# Altium schematic sheet 01.SchDoc
size 420 x 297 mm
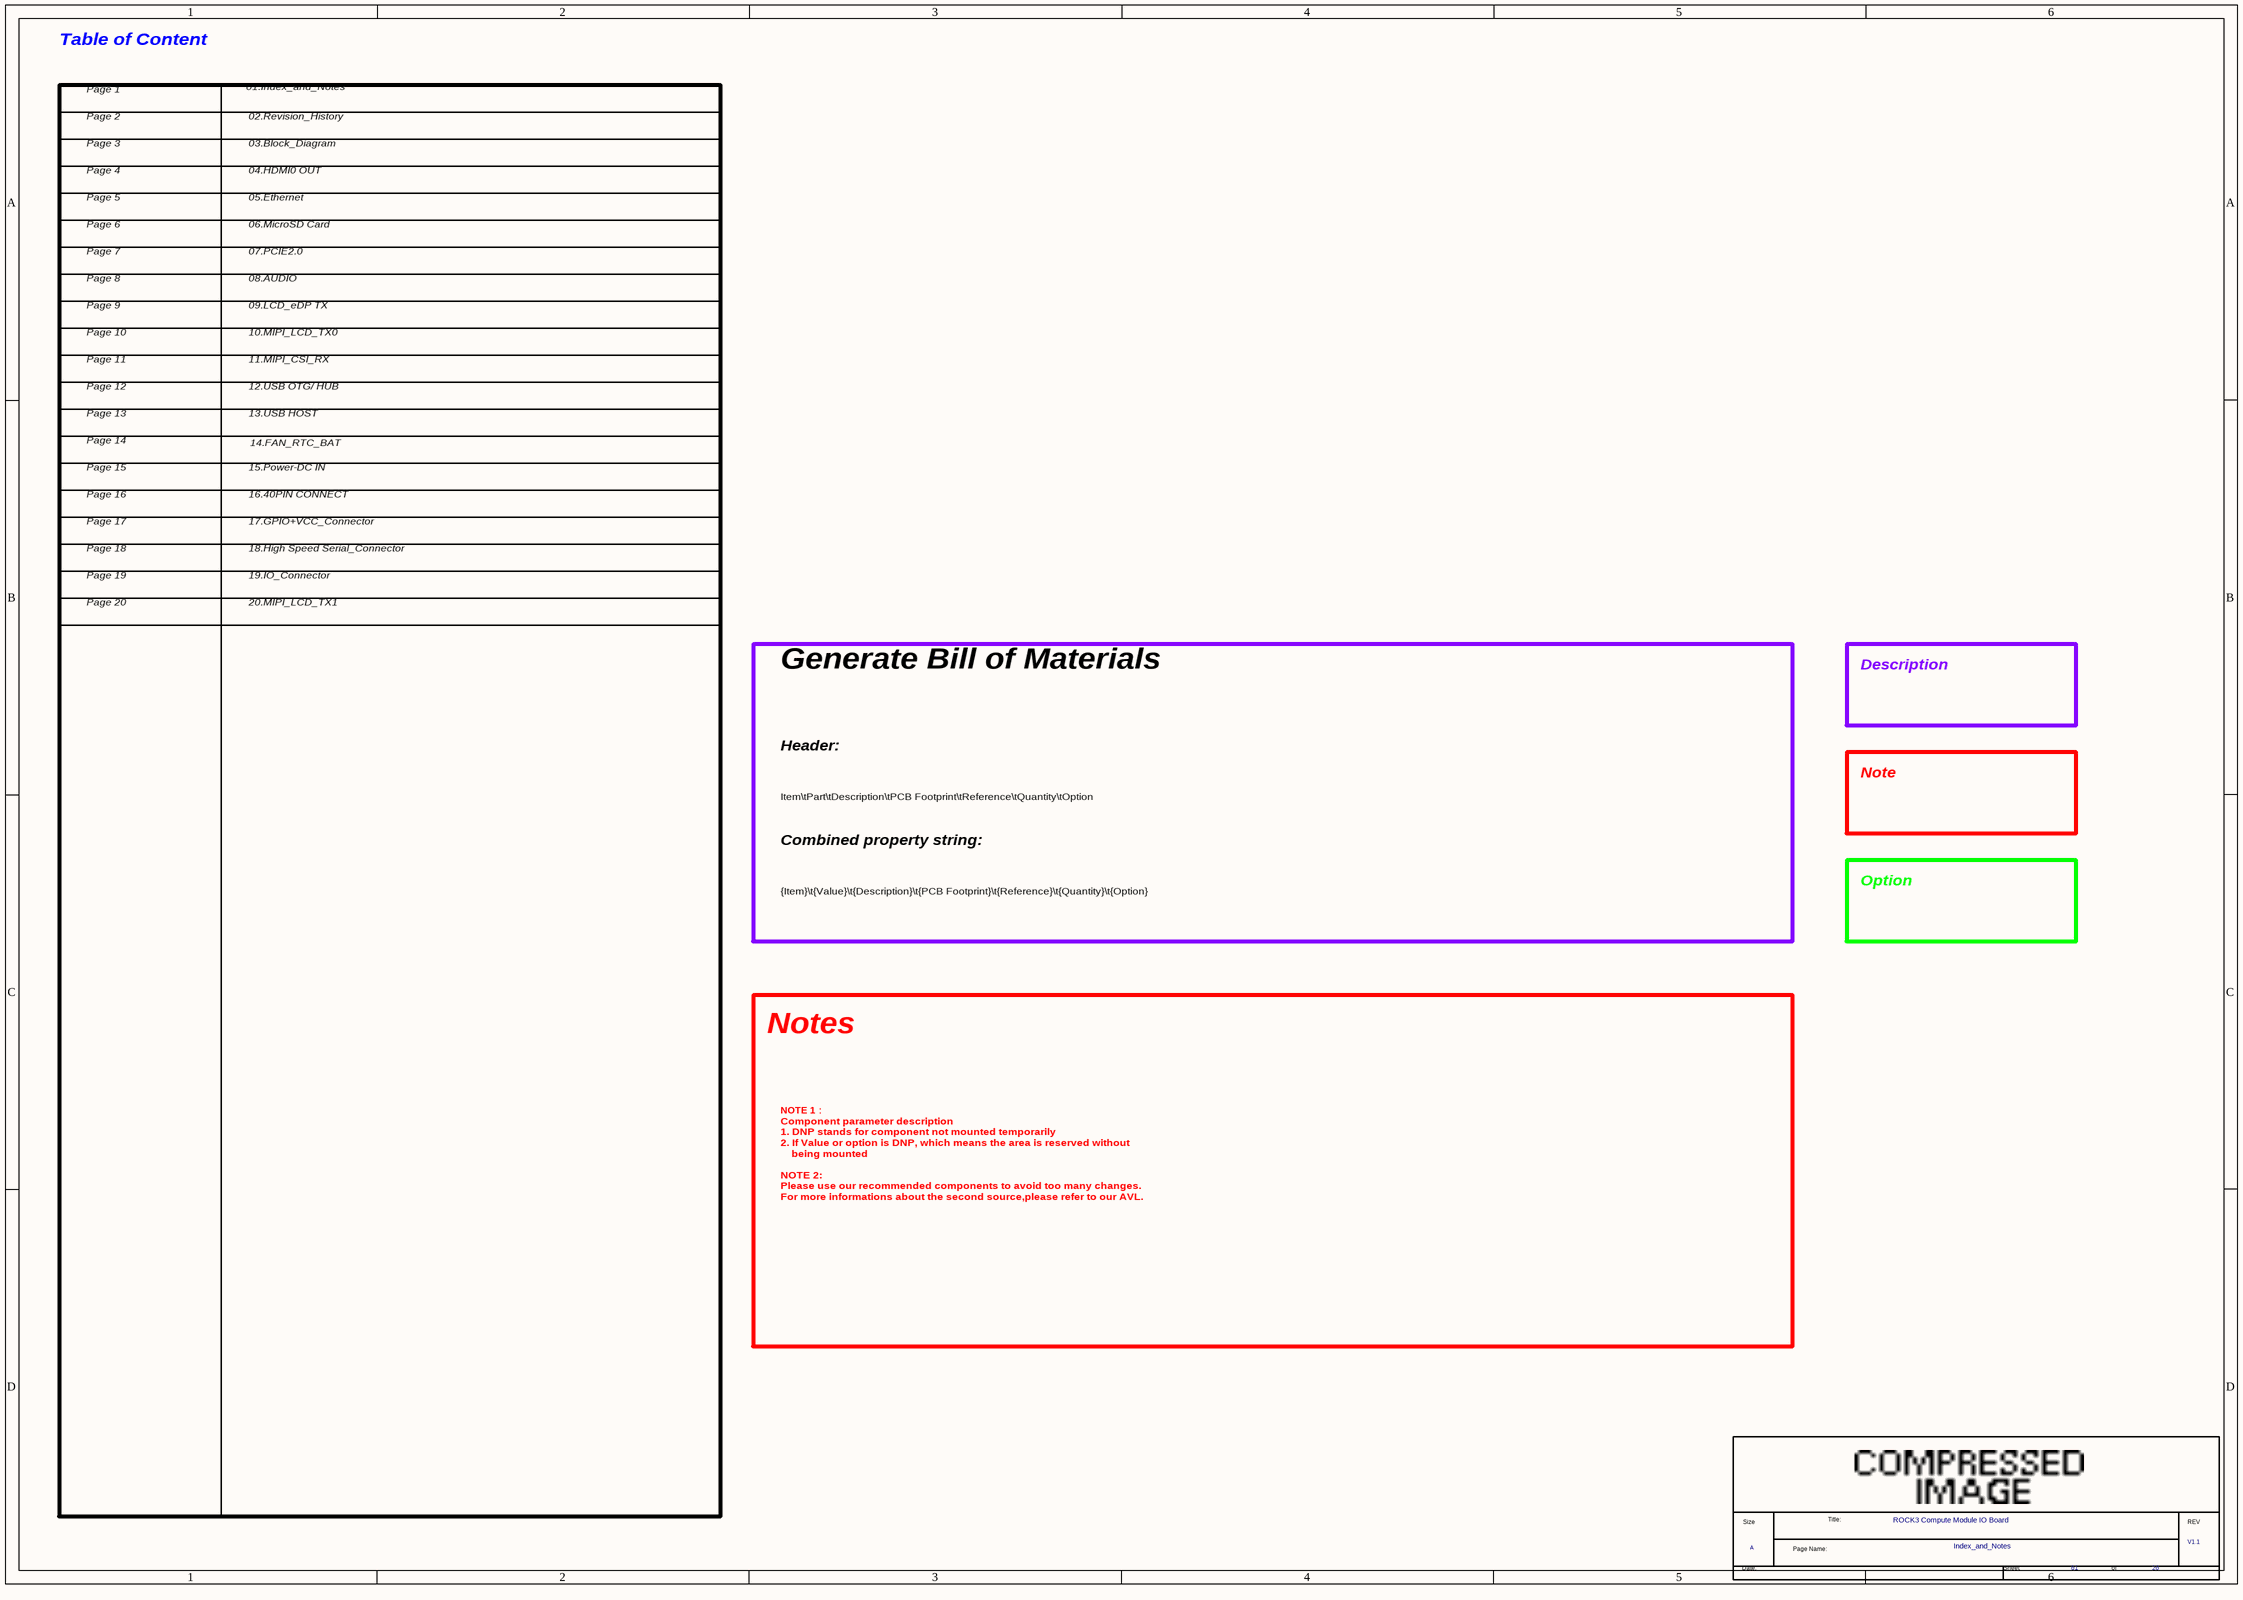
[diagram p0: 01.SchDoc]

## Parts
*  Page Count: 20  Page Number: 01  Page Size: A  Title: ROCK3 Compute Module IO Board  RevCode: V1.1  Doc: Index_and_Notes  (hidden comment: radxa_gong)  (graphical)

## Notes on the sheet
- Table of Content
- Page 2
- Page 1
- 01.Index_and_Notes
- 02.Revision_History
- Page 3
- Page 4
- 03.Block_Diagram
- 04.HDMI0 OUT
- Page 5
- Page 6
- Page 7
- 05.Ethernet
- 06.MicroSD Card
- 07.PCIE2.0
- Page 8
- Page 9
- 08.AUDIO
- 09.LCD_eDP TX
- Page 10
- Page 11
- Page 12
- 11.MIPI_CSI_RX
- 10.MIPI_LCD_TX0
- 12.USB OTG/ HUB
- Page 13
- Page 14
- 13.USB HOST
- 14.FAN_RTC_BAT
- Page 15
- Page 16
- Page 17
- 15.Power-DC IN
- 16.40PIN CONNECT
- 17.GPIO+VCC_Connector
- Page 18
- Page 19
- 18.High Speed Serial_Connector
- 19.IO_Connector
- Page 20
- 20.MIPI_LCD_TX1
- Generate Bill of Materials
- Description
- Header:
- Item\tPart\tDescription\tPCB Footprint\tReference\tQuantity\tOption
- Note
- Combined property string:
- {Item}\t{Value}\t{Description}\t{PCB Footprint}\t{Reference}\t{Quantity}\t{Option}
- Option
- Notes
- NOTE 1：
  Component parameter description
  1. DNP stands for component not mounted temporarily
  2. If Value or option is DNP, which means the area is reserved without
  being mounted
  NOTE 2:
  Please use our recommended components to avoid too many changes.
  For more informations about the second source,please refer to our AVL.
- (in symbol radxa_gong) Title:; Size; REV; Page Name:; Date:; Sheet; of

## Library data of the parts
* = radxa_gong: Page Create Date: March  8, 1995